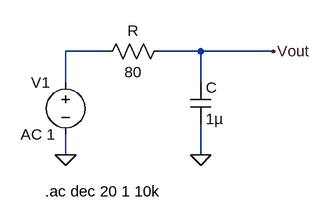
[diagram p0: schematic Filter.asc]
Filter.asc, the LTspice schematic file:
Version 4
SHEET 1 880 680
WIRE 112 96 48 96
WIRE 256 96 192 96
WIRE 368 96 256 96
WIRE 48 144 48 96
WIRE 256 144 256 96
WIRE 48 256 48 224
WIRE 256 256 256 208
FLAG 48 256 0
FLAG 256 256 0
FLAG 368 96 Vout
SYMBOL cap 240 144 R0
SYMATTR InstName C
SYMATTR Value 1µ
SYMBOL res 208 80 R90
WINDOW 0 0 56 VBottom 2
WINDOW 3 32 56 VTop 2
SYMATTR InstName R
SYMATTR Value 80
SYMBOL voltage 48 128 M0
WINDOW 123 16 96 Left 2
WINDOW 39 0 0 Left 0
SYMATTR Value2 AC 1
SYMATTR InstName V1
SYMATTR Value ""
TEXT 16 312 Left 2 !.ac dec 20 1 10k

The netlist it stands for:
* Filter.asc
C Vout 0 1µ
R Vout N001 80
V1 N001 0 AC 1
.ac dec 20 1 10k
.backanno
.end